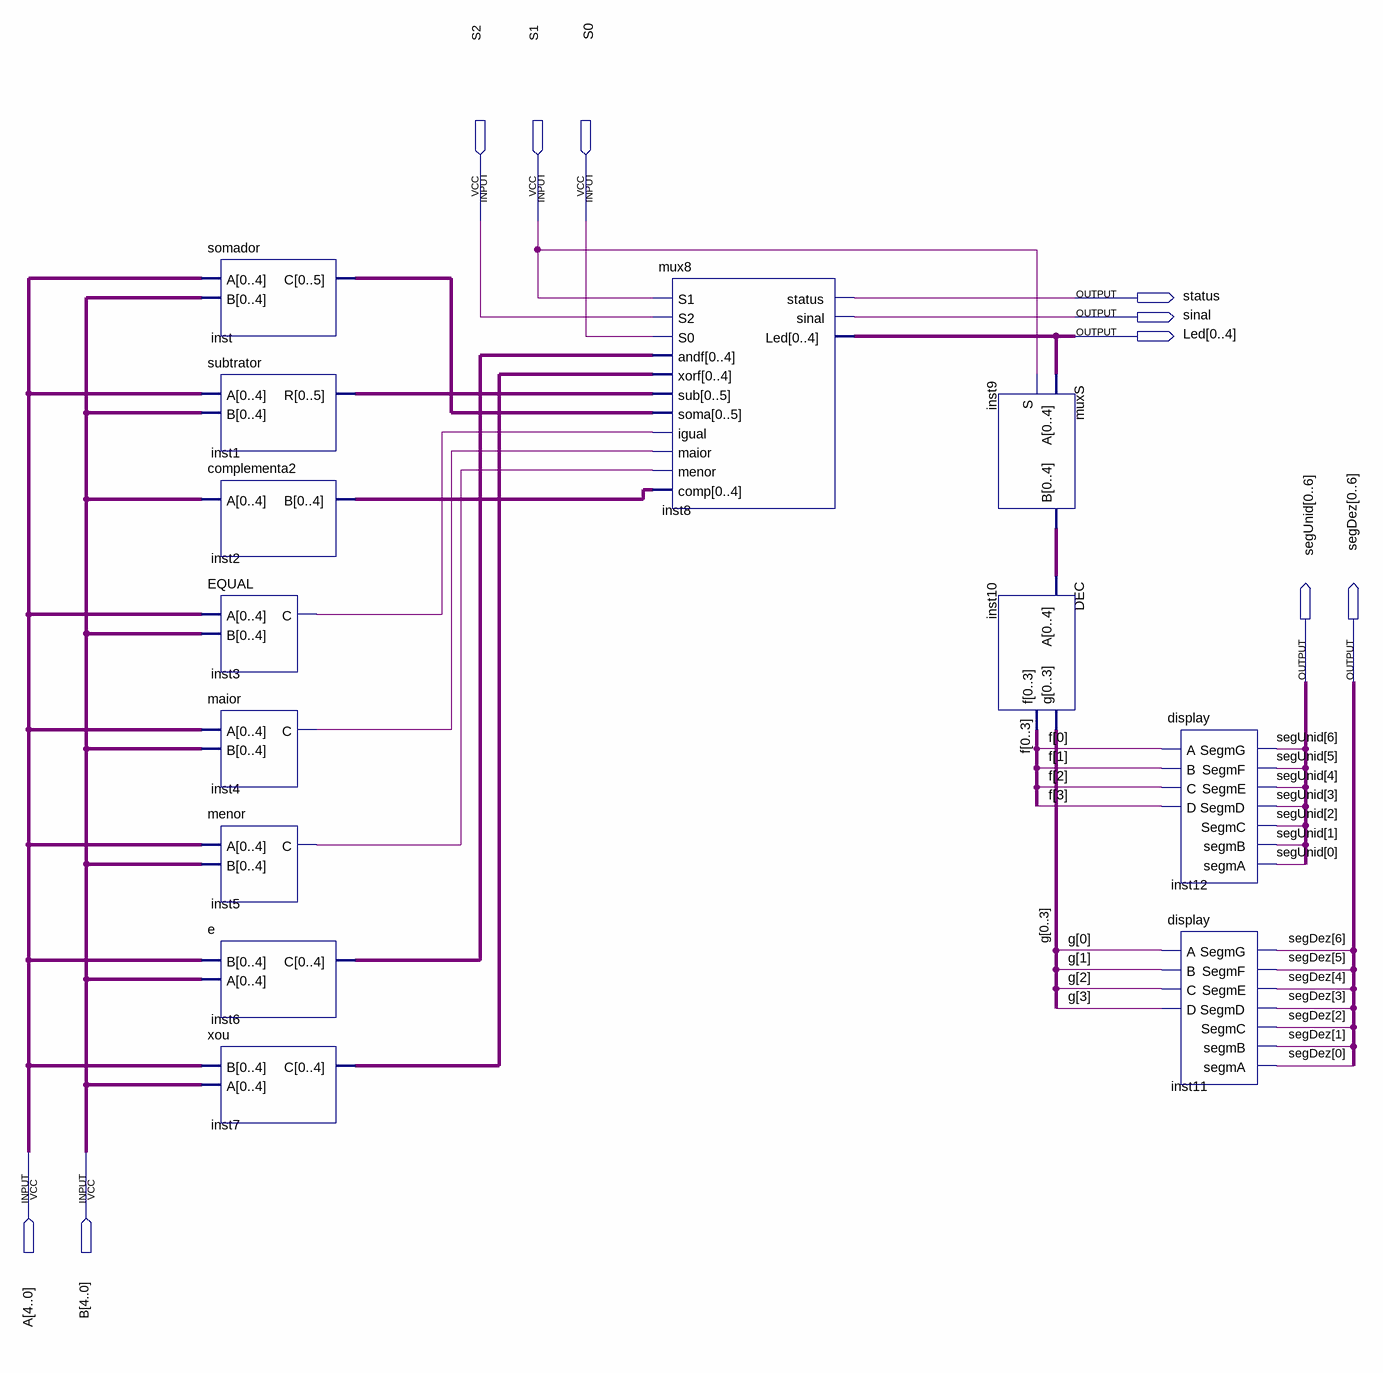
[diagram p0: schematic sheet]
// Quartus schematic projULA.bdf as structural Verilog: 13 symbols, 10 pins
module projULA (
  input  S2,
  input  S1,
  input  S0,
  input  [4:0] A,
  input  [4:0] B,
  output status,
  output sinal,
  output [0:4] Led,
  output [0:6] segUnid,
  output [0:6] segDez
);

  wire inst3_c, inst4_c, inst5_c;
  wire [3:0] f, g;
  wire [4:0] inst2_b, inst6_c, inst7_c, inst9_b;
  wire [5:0] inst1_r, inst_c;

  somador inst (.A(A), .B(B), .C(inst_c));
  subtrator inst1 (.A(A), .B(B), .R(inst1_r));
  complementa2 inst2 (.A(B), .B(inst2_b));
  EQUAL inst3 (.A(A), .B(B), .C(inst3_c));
  maior inst4 (.A(A), .B(B), .C(inst4_c));
  menor inst5 (.A(A), .B(B), .C(inst5_c));
  e inst6 (.B(A), .A(B), .C(inst6_c));
  xou inst7 (.B(A), .A(B), .C(inst7_c));
  mux8 inst8 (
    .S1(S1), .S2(S2), .S0(S0), .andf(inst6_c), .xorf(inst7_c), .sub(inst1_r), .soma(inst_c), .igual(inst3_c),
    .maior(inst4_c), .menor(inst5_c), .comp(inst2_b), .status(status), .sinal(sinal), .Led(Led));
  muxS inst9 (.A(Led), .S(S1), .B(inst9_b));
  DEC inst10 (.A(inst9_b), .g({g[0], g[1], g[2], g[3]}), .f({f[0], f[1], f[2], f[3]}));
  display inst12 (
    .A(f[0]), .B(f[1]), .C(f[2]), .D(f[3]), .SegmG(segUnid[6]), .SegmF(segUnid[5]), .SegmE(segUnid[4]),
    .SegmD(segUnid[3]), .SegmC(segUnid[2]), .segmB(segUnid[1]), .segmA(segUnid[0]));
  display inst11 (
    .A(g[0]), .B(g[1]), .C(g[2]), .D(g[3]), .SegmG(segDez[6]), .SegmF(segDez[5]), .SegmE(segDez[4]),
    .SegmD(segDez[3]), .SegmC(segDez[2]), .segmB(segDez[1]), .segmA(segDez[0]));
endmodule
